# EAGLE design Large Digit Driver (EAGLE 7.5.0)
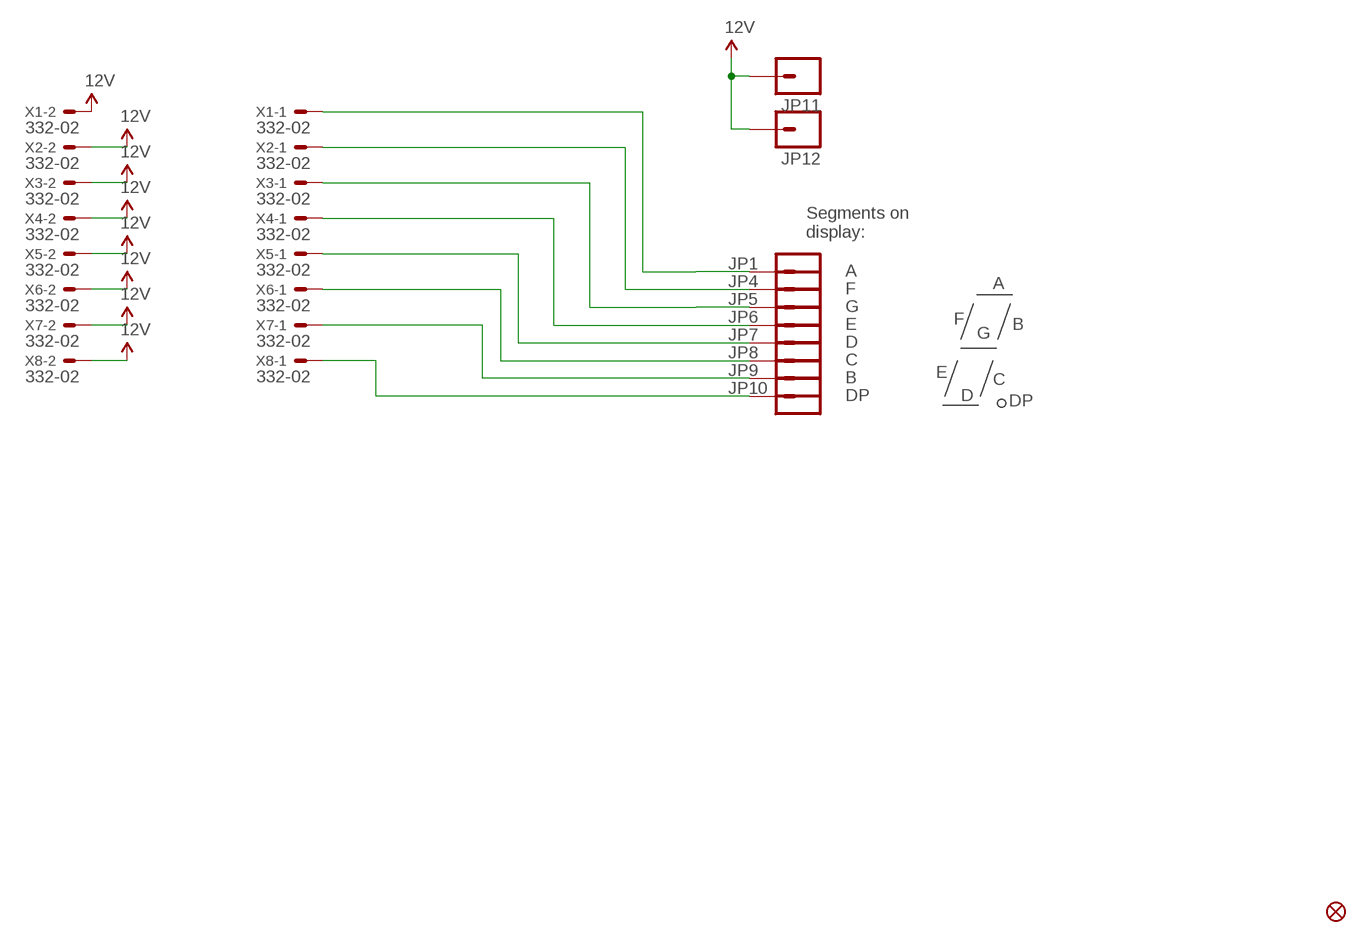
[diagram p0: schematic, sheet 1]

## Parts
FID2  FIDUCIAL1X2  [FIDUCIAL-1X2]
JP1  M01PTH_LONGPAD  [1X01_LONGPAD]
JP4  M01PTH_LONGPAD  [1X01_LONGPAD]
JP5  M01PTH_LONGPAD  [1X01_LONGPAD]
JP6  M01PTH_LONGPAD  [1X01_LONGPAD]
JP7  M01PTH_LONGPAD  [1X01_LONGPAD]
JP8  M01PTH_LONGPAD  [1X01_LONGPAD]
JP9  M01PTH_LONGPAD  [1X01_LONGPAD]
JP10  M01PTH_LONGPAD  [1X01_LONGPAD]
JP11  M01PTH_LONGPAD  [1X01_LONGPAD]
JP12  M01PTH_LONGPAD  [1X01_LONGPAD]
X1  332-02  [332-02]
X2  332-02  [332-02]
X3  332-02  [332-02]
X4  332-02  [332-02]
X5  332-02  [332-02]
X6  332-02  [332-02]
X7  332-02  [332-02]
X8  332-02  [332-02]

## Nets
12V: JP11.1 JP12.1 X1.2 X2.2 X3.2 X4.2 X5.2 X6.2 X7.2 X8.2
N$1: JP9.1 X7.1
S0: JP1.1 X1.1
S1: JP4.1 X2.1
S2: JP5.1 X3.1
S3: JP6.1 X4.1
S4: JP7.1 X5.1
S5: JP8.1 X6.1
S7: JP10.1 X8.1

## Notes on the sheet
- Segments on
  display:
- A
- A
- F
- G
- F
- E | B
- G
- D
- C
- E
- B | C
- DP | D
- DP

## Library data of the parts
FID2 = SparkFun-Aesthetics:FIDUCIAL: Fiducial Alignment Points Various fiducial points for machine vision alignment.
JP1 JP4-JP12 = SparkFun-Connectors:M01: Header 1 Standard 1-pin 0.1" header. Use with straight break away headers (SKU : PRT-00116), right angle break away headers (PRT-00553), swiss pins (PRT-00743), machine pins (PRT-00117), and female headers (PRT-00115).
X1-X8 = con-garry:332-02: 2 Pin - 2mm Dual Row Source: www.mpe-connector.de / garry_shortform_2012.pdf

## Net classes
1 power: width 0.203 mm

## Board
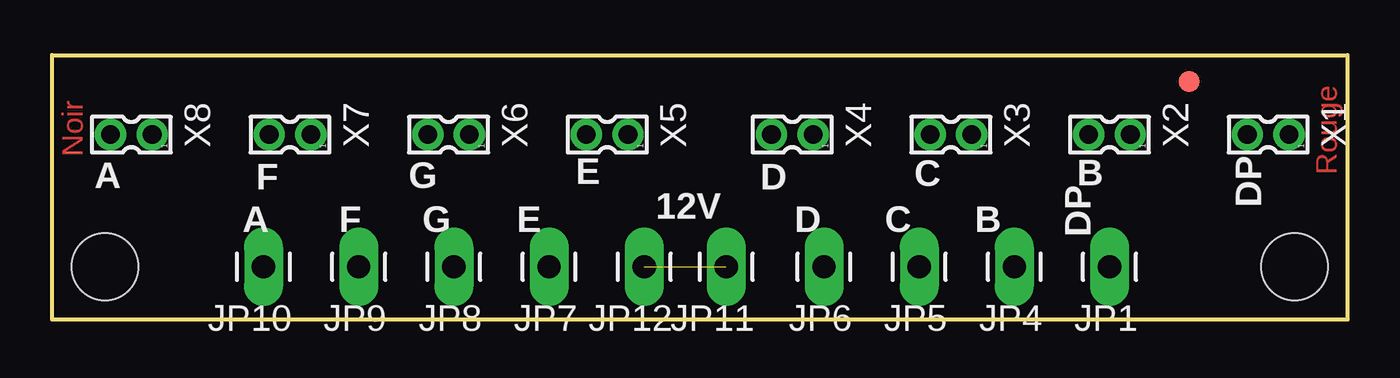
[diagram p1: board, top side]
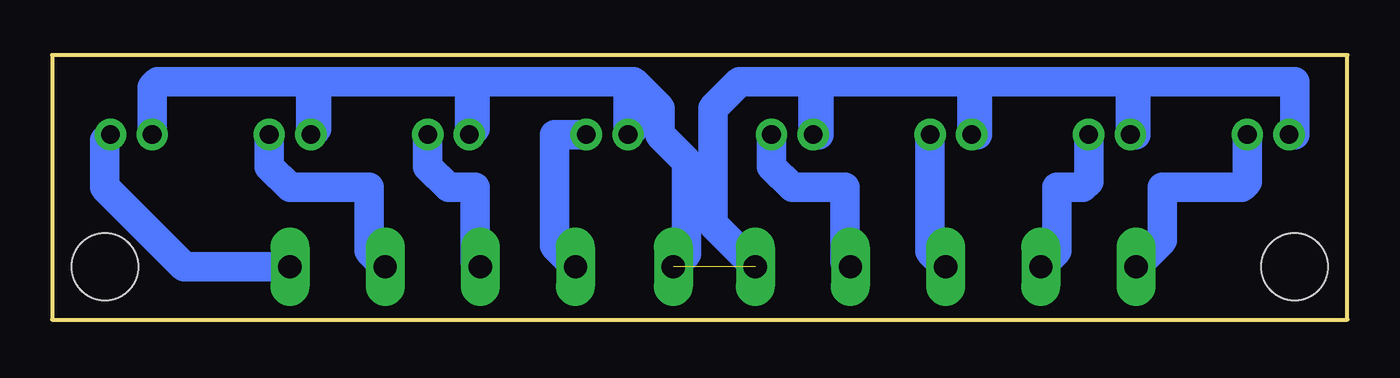
[diagram p2: board, bottom side, seen from below]

Size 62.23 x 12.7 mm. Coordinates in mm from the lower left corner, seen from the top.
Outline: 0,12.7 62.23,12.7 62.23,0 0,0 0,12.7
Copper layers (1*16): Top 0.035mm / dielectric 1.5mm / Bottom 0.035mm
Design rules "SparkFun-2-layer *": minimum track width 40mil, minimum drill 15mil, track to track 8mil, track to pad 8mil, pad to pad 8mil, via to via 8mil, smd to smd 8mil, copper to edge 8mil, drill to drill 8mil, minimum pad ring 12mil, minimum via ring 10mil, stop-mask expansion 4mil, vias tented up to drill 20mil, thermal gap 10mil
Holes 3.2 mm at 2.54,2.54 59.69,2.54

### Footprints (pad centres in the part's own frame; a part is rotated, then mirrored left to right if it is on the bottom)
FIDUCIAL-1X2 = smd 1 x 1: 1 0,0
1X01_LONGPAD = drill 1.118 pad 1.88 long: 1 0,0
332-02 = drill 0.9 pad 1.27: 1 0,-1; 2 0,1

### Placement (x,y rotation side)
FID2  54.61,11.43 0 top
JP1  50.8,2.54 180 top
JP4  46.23,2.54 180 top
JP5  41.66,2.54 180 top
JP6  37.08,2.54 180 top
JP7  23.88,2.54 180 top
JP8  19.3,2.54 180 top
JP9  14.73,2.54 180 top
JP10  10.16,2.54 180 top
JP11  32.38,2.54 180 top
JP12  28.45,2.54 180 top
X1  58.42,8.89 90 top
X2  50.8,8.89 90 top
X3  43.18,8.89 90 top
X4  35.56,8.89 90 top
X5  26.67,8.89 90 top
X6  19.05,8.89 90 top
X7  11.43,8.89 90 top
X8  3.81,8.89 90 top

### Tracks (layer width: path | path; a pad name or v marks a point on that pad's centre or on a via)
12V  (1 unrouted)
  Bottom 1.422: X8.2 2.54,8.89 2.54,11.43 10.16,11.43 | 10.16,11.43 10.43,11.43 | 10.43,11.43 X7.2 10.16,8.89 10.16,11.43 | 10.43,11.43 17.78,11.43 | 17.78,11.43 18.05,11.43 | 18.05,11.43 X6.2 17.78,8.89 17.78,11.43 | 18.05,11.43 25.4,11.43 | 25.4,11.43 25.67,11.43 | 25.67,11.43 X5.2 25.4,8.89 25.4,11.43 | 25.67,11.43 29.21,11.43 30.48,10.16 30.48,4.57 JP12.1 | X1.2 57.42,11.16 57.15,11.43 49.53,11.43 | 49.53,11.43 49.53,9.16 X2.2 49.8,11.16 49.53,11.43 | 49.53,11.43 41.91,11.43 | 41.91,11.43 41.91,9.16 X3.2 42.18,11.16 41.91,11.43 | 41.91,11.43 34.29,11.43 | 34.29,11.43 34.29,9.16 X4.2 34.56,11.16 34.29,11.43 | 34.29,11.43 33.02,10.16 33.02,8.89 31.75,7.62 31.75,3.17 JP11.1
N$1
  Bottom 1.422: X7.1 12.43,6.62 12.7,6.35 13.97,6.35 13.97,3.3 JP9.1
S0
  Bottom 1.422: JP1.1 55.88,2.54 59.69,6.35 59.69,8.62 X1.1
S1
  Bottom 1.422: X2.1 51.8,7.35 50.8,6.35 46.99,6.35 46.99,3.3 JP4.1
S2
  Bottom 1.422: X3.1 44.18,7.35 43.18,6.35 41.91,6.35 41.91,2.79 JP5.1
S3
  Bottom 1.422: X4.1 38.1,8.89 38.1,3.56 JP6.1
S4
  Bottom 1.422: X5.1 27.67,7.35 26.67,6.35 24.13,6.35 24.13,2.79 JP7.1
S5
  Bottom 1.422: X6.1 20.05,3.29 JP8.1
S7
  Bottom 1.422: X8.1 4.81,6.62 5.08,6.35 8.89,6.35 8.89,3.81 JP10.1

### Text on the board
Top: Rouge | Noir
tPlace: A | F | G | E | D | C | B | DP | 12V | DP | A | F | G | E | D | C | B